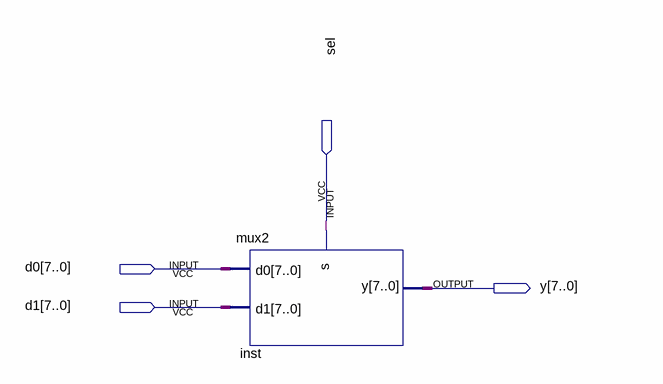
[diagram p0: schematic sheet]
// Quartus schematic test.bdf as structural Verilog: 1 symbols, 4 pins
module test (
  input  sel,
  input  [7:0] d0,
  input  [7:0] d1,
  output [7:0] y
);

  mux2 inst (.d0(d0), .d1(d1), .s(sel), .y(y));
endmodule
